# Altium schematic sheet Diagram.SchDoc
size A
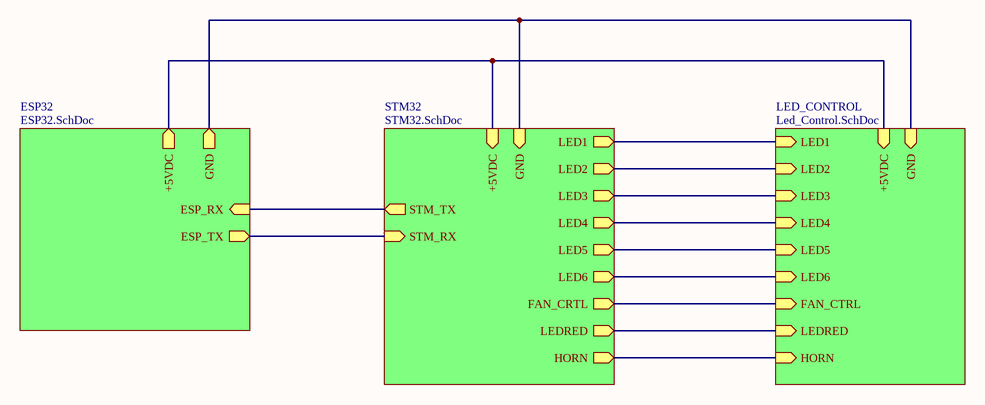
[diagram p0: Diagram.SchDoc]

## Sub-sheets
ESP32 = ESP32.SchDoc: ESP_RX (in), ESP_TX (out), GND (out), +5VDC (out)
LED_CONTROL = Led_Control.SchDoc: LED1 (in), LED2 (in), LED3 (in), LED4 (in), LED5 (in), LED6 (in), FAN_CTRL (in), LEDRED (in), HORN (in), GND (in), +5VDC (in)
STM32 = STM32.SchDoc: LED1 (out), LED2 (out), LED3 (out), LED4 (out), LED5 (out), LED6 (out), FAN_CRTL (out), LEDRED (out), HORN (out), STM_TX (out), STM_RX (in), +5VDC (in), GND (in)

## Nets
(unnamed): sheet STM32/LED1, sheet LED_CONTROL/LED1
(unnamed): sheet STM32/LED2, sheet LED_CONTROL/LED2
(unnamed): sheet STM32/LED3, sheet LED_CONTROL/LED3
(unnamed): sheet STM32/LED4, sheet LED_CONTROL/LED4
(unnamed): sheet STM32/LED5, sheet LED_CONTROL/LED5
(unnamed): sheet STM32/LED6, sheet LED_CONTROL/LED6
(unnamed): sheet STM32/FAN_CRTL, sheet LED_CONTROL/FAN_CTRL
(unnamed): sheet STM32/LEDRED, sheet LED_CONTROL/LEDRED
(unnamed): sheet STM32/HORN, sheet LED_CONTROL/HORN
(unnamed): sheet STM32/STM_TX, sheet ESP32/ESP_RX
(unnamed): sheet STM32/STM_RX, sheet ESP32/ESP_TX
(unnamed): sheet STM32/+5VDC, sheet ESP32/+5VDC, sheet LED_CONTROL/+5VDC
(unnamed): sheet STM32/GND, sheet ESP32/GND, sheet LED_CONTROL/GND